# EAGLE schematic mp28164-buck-boost-flashlight-driver-tester-mk-1.0.4.opamp.only (EAGLE 9.2.2)
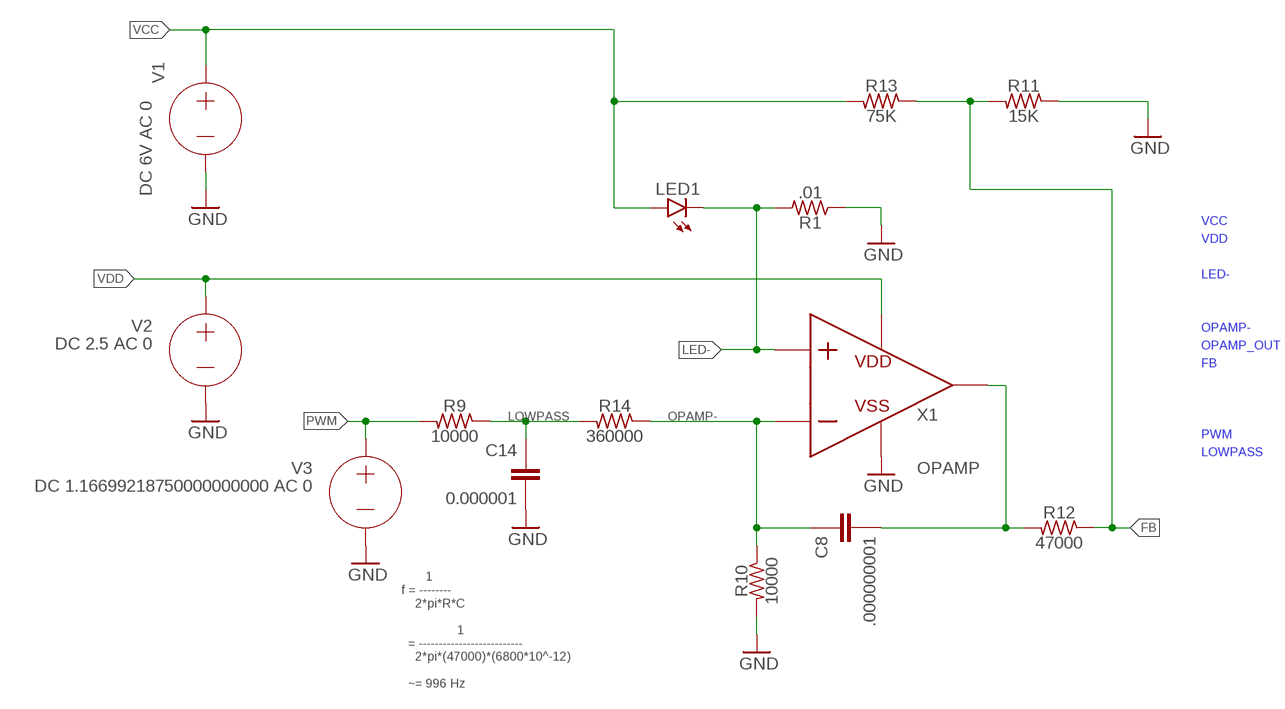
[diagram p0: schematic, sheet 1]

## Parts
C8  .000000001  CAPACITOR-CERAMICC0402  [C0402]
C14  0.000001  CAPACITOR-CERAMICC0402  [C0402]
LED1  LED3MM  [LED3MM]
R1  .01  RESISTORR0805-TIGHTER  [R0805-TIGHTER]
R9  10000  RESISTORR0402  [R0402]
R10  10000  RESISTORR0402  [R0402]
R11  15K  RESISTORR0402  [R0402]
R12  47000  RESISTORR0402  [R0402]
R13  75K  RESISTORR0402  [R0402]
R14  360000  RESISTORR0402  [R0402]
V1  DC 6V AC 0  VOLTAGE  (no package)
V2  DC 2.5 AC 0  VOLTAGE  (no package)
V3  DC 1.16699218750000000000 AC 0  VOLTAGE  (no package)
X1  OPAMP  (no package)

## Nets
FB: R11.2 R12.1 R13.1
GND: C14.2 R1.1 R10.2 R11.1 V1.- V2.- V3.- X1.VSS
LED-: LED1.K(C) R1.2 X1.P
LOWPASS: C14.1 R9.1 R14.2
OPAMP-: C8.1 R10.1 R14.1 X1.N
OPAMP_OUT: C8.2 R12.2 X1.VOUT
PWM: R9.2 V3.+
VCC: LED1.A R13.2 V1.+
VDD: V2.+ X1.VDD

## Notes on the sheet
- 1
  f = --------
      2*pi*R*C
  
                  1
    = --------------------------
      2*pi*(47000)*(6800*10^-12)
  
    ~= 996 Hz

## Library data of the parts
C8 C14 = a_parts:CAPACITOR-CERAMIC: CAPACITOR, European symbol; SPICEPREFIX: C
LED1 = a_parts:LED: LEDs Standard schematic elements and footprints for 5mm, 3mm, 1206, and 0603 sized LEDs. 5mm - Spark Fun Electronics SKU : COM-00529 (and others); SPICEMODEL: DMOD; SPICEPREFIX: D
R1 R9-R14 = a_parts:RESISTOR: RESISTOR, American symbol; SPICEPREFIX: R
V1-V3 = ngspice-simulation:VOLTAGE: Independent Voltage Source, either DC, AC, PULSE, SINE, PWL, EXP, or SFFM; VALUE: 0V
X1 = ngspice-simulation:OPAMP: Operational amplifier with power pins; SPICEMODEL: OPAMP; SPICEPREFIX: X